# Altium schematic sheet P5d_Filter2B.SchDoc
size A
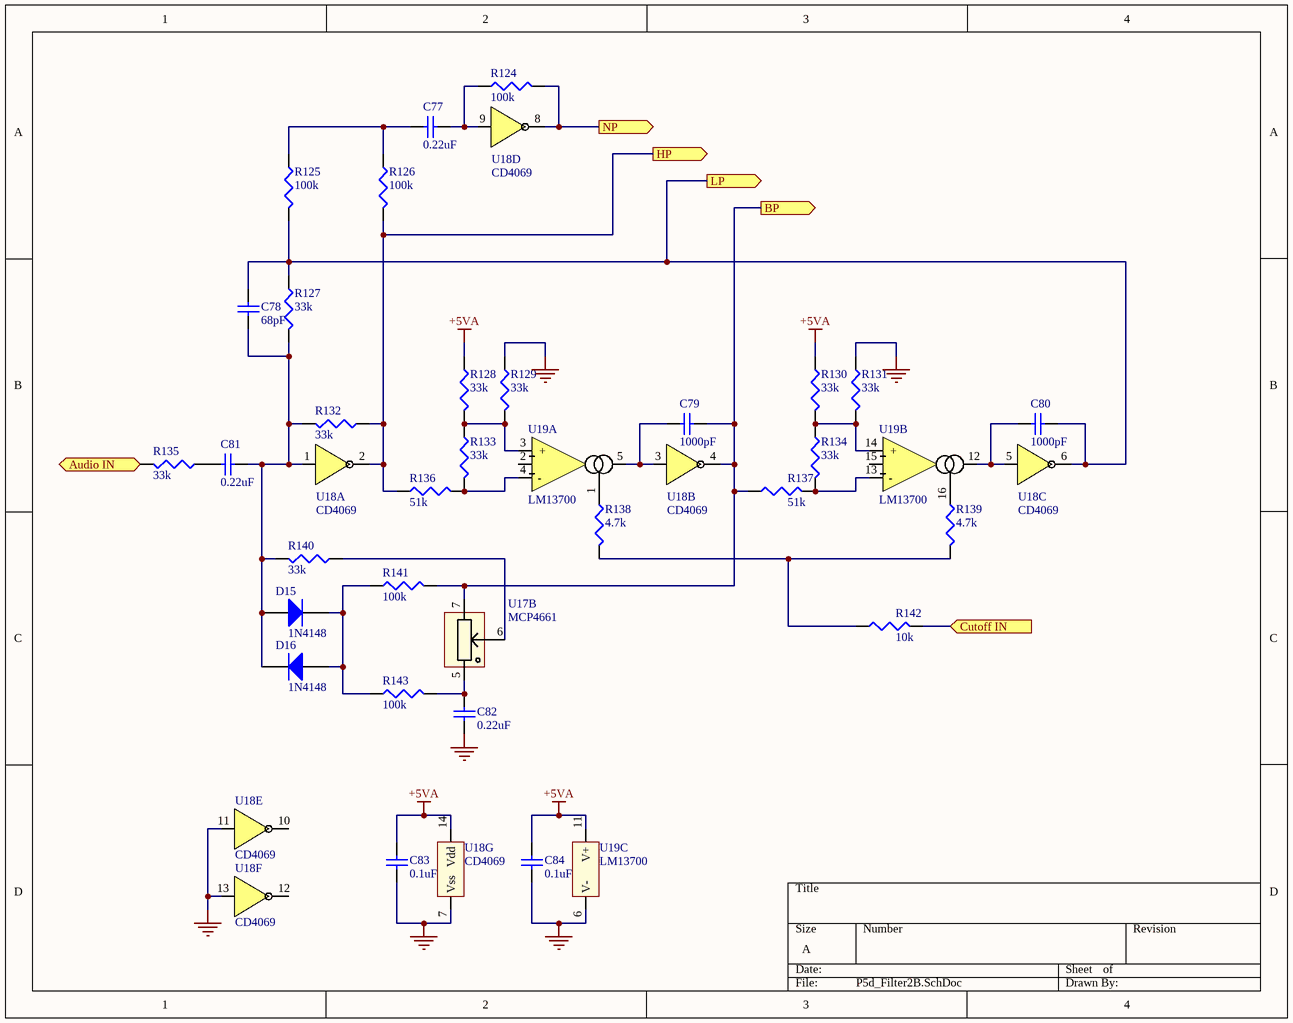
[diagram p0: P5d_Filter2B.SchDoc]

## Parts
C77  0.22uF  [CAP 0603 (1608 metric)]
C78  68pF  [CAP 0603 (1608 metric)]
C79  1000pF  [CAP 0603 (1608 metric)]
C80  1000pF  [CAP 0603 (1608 metric)]
C81  0.22uF  [CAP 0603 (1608 metric)]
C82  0.22uF  [CAP 0603 (1608 metric)]
C83  0.1uF  [CAP 0603 (1608 metric)]
C84  0.1uF  [CAP 0603 (1608 metric)]
D15  1N4148
D16  1N4148
R124  100k  [RES 0603 (1608 metric)]
R125  100k  [RES 0603 (1608 metric)]
R126  100k  [RES 0603 (1608 metric)]
R127  33k  [RES 0603 (1608 metric)]
R128  33k  [RES 0603 (1608 metric)]
R129  33k  [RES 0603 (1608 metric)]
R130  33k  [RES 0603 (1608 metric)]
R131  33k  [RES 0603 (1608 metric)]
R132  33k  [RES 0603 (1608 metric)]
R133  33k  [RES 0603 (1608 metric)]
R134  33k  [RES 0603 (1608 metric)]
R135  33k  [RES 0603 (1608 metric)]
R136  51k  [RES 0603 (1608 metric)]
R137  51k  [RES 0603 (1608 metric)]
R138  4.7k  [RES 0603 (1608 metric)]
R139  4.7k  [RES 0603 (1608 metric)]
R140  33k  [RES 0603 (1608 metric)]
R141  100k  [RES 0603 (1608 metric)]
R142  10k  [RES 0603 (1608 metric)]
R143  100k  [RES 0603 (1608 metric)]
U17  MCP4661  (part B of 4)
U18  CD4069  (parts A,B,C,D,E,F,G of 7)
U19  LM13700  (parts A,B,C of 3)

## Ports
Audio IN (in), BP (out), Cutoff IN (in), HP (out), LP (out), NP (out)

## Nets
+5VA: C83.1 C84.1 R128.1 R130.1 U18.14(Vdd) U19.11(V+)
GND: C82.2 C83.2 C84.2 R129.1 R131.1 U18.7(Vss) U18.11(E) U18.13(F) U19.6(V-)
Audio IN: R135.2 ; port Audio IN
BP: C79.2 R137.1 R141.2 U17.7(P1A) U18.4(~{B}) ; port BP
Cutoff IN: R142.2 ; port Cutoff IN
HP: R126.2 R132.1 R136.1 U18.2(~{A}) ; port HP
LP: C78.2 C80.2 R125.2 R127.1 U18.6(~{C}) ; port LP
NP: R124.2 U18.8(~{D}) ; port NP
NetC77_1: C77.1 R125.1 R126.1
NetC77_2: C77.2 R124.1 U18.9(D)
NetC78_1: C78.1 C81.2 D15.1(A) D16.2(K) R127.2 R132.2 R140.2 U18.1(A)
NetC79_1: C79.1 U18.3(B) U19.5(OUT)
NetC80_1: C80.1 U18.5(C) U19.12(OUT)
NetC81_1: C81.1 R135.1
NetC82_1: C82.1 R143.2 U17.5(P1B)
NetD15_2: D15.2(K) D16.1(A) R141.1 R143.1
NetR128_2: R128.2 R129.2 R133.1 U19.3(+)
NetR130_2: R130.2 R131.2 R134.1 U19.14(+)
NetR133_2: R133.2 R136.2 U19.4(-)
NetR134_2: R134.2 R137.2 U19.13(-)
NetR138_1: R138.1 U19.1(BIAS)
NetR138_2: R138.2 R139.2 R142.1
NetR139_1: R139.1 U19.16(BIAS)
NetR140_1: R140.1 U17.6(P1W)

Not connected (* = marked no-connect by the designer): U18 10(~{E}) 12(~{F}); U19 2(Diode_BIAS) 15(Diode_BIAS)

## Library data of the parts
C77-C84 = Cap Semi: Capacitor (Semiconductor SIM Model)
  C77 C81 C82: Value: 0.22uF
  C78: Value: 68pF
  C79 C80: Value: 1000pF
  C83 C84: Value: 0.1uF
D15 D16 = Diode 1N4148: High Conductance Fast Diode
R124-R143 = Res3: Resistor
  R124-R126 R141 R143: Value: 100k
  R127-R135 R140: Value: 33k
  R136 R137: Value: 51k
  R138 R139: Value: 4.7k
  R142: Value: 10k
U17 = MCP4661: Dual DigiPot non volatile I2C
U18 = CD4069: Hex Inverter
U19 = LM13700M: Dual Transconductance OpAmp